# Altium schematic sheet Connectors.SchDoc
size 420 x 297 mm; Organization: Develer s.r.l.; Address1: via Mugellese 1/A; Address2: 50019 Campi Bisenzio; Address3: Firenze; Address4: ITALY; Revision: A; SheetNumber: 1; SheetTotal: 1
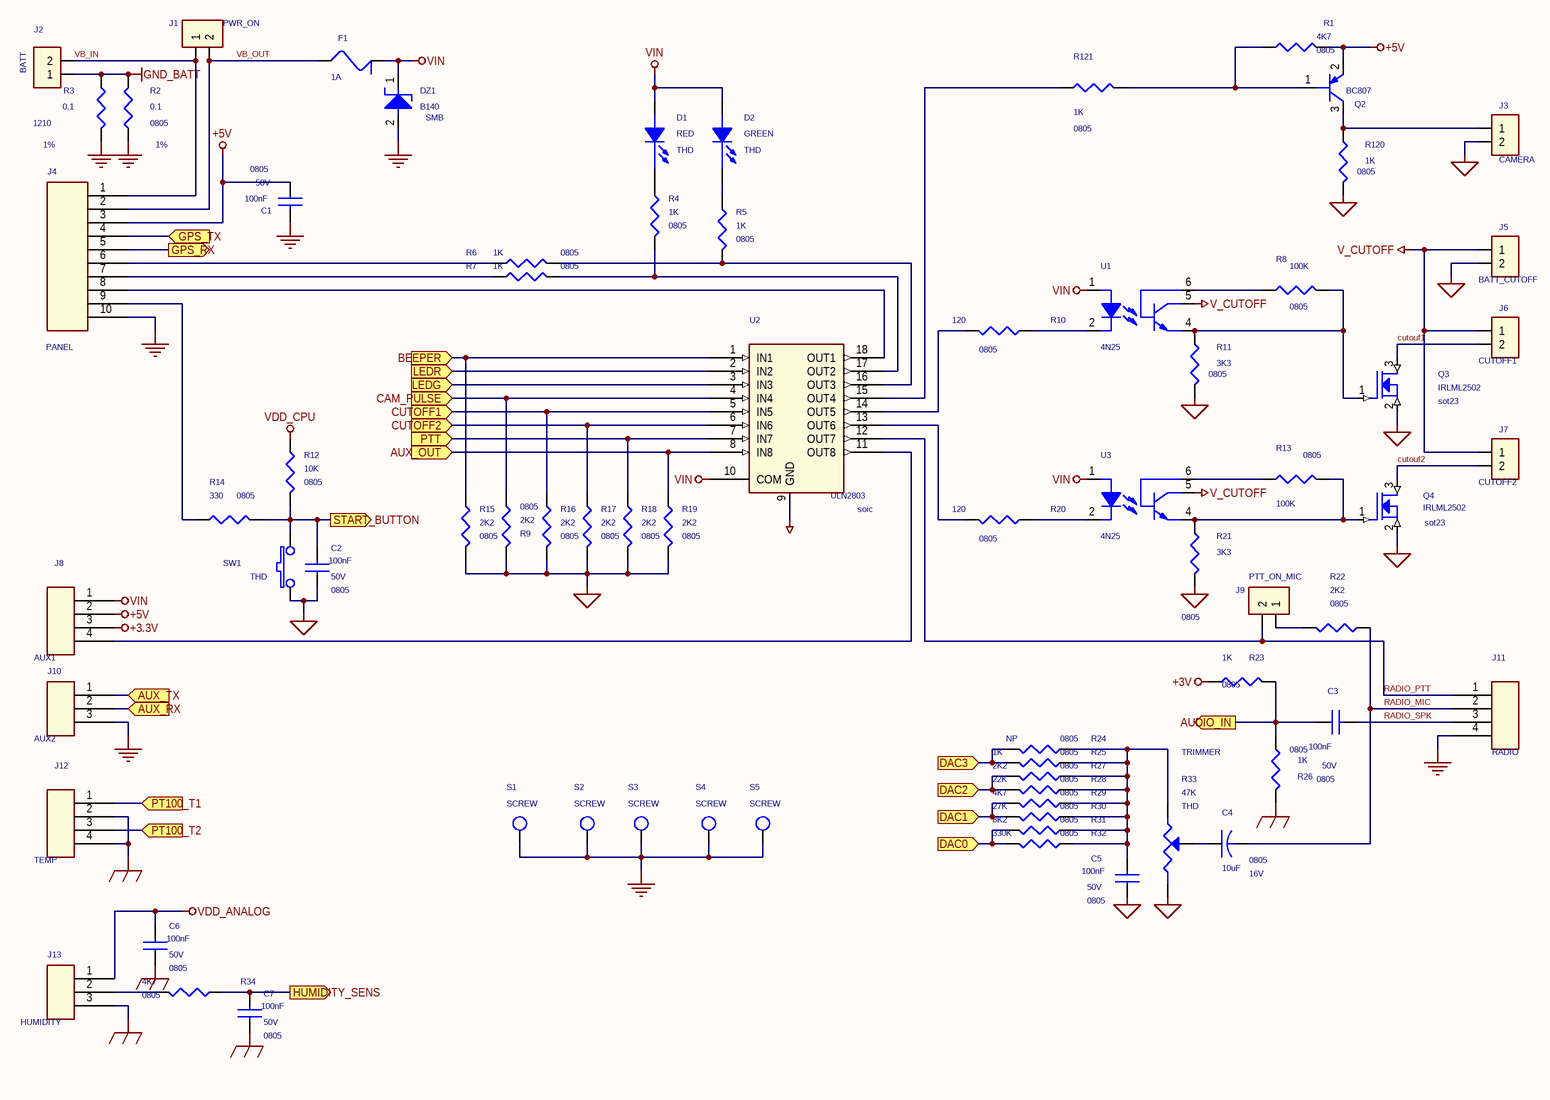
[diagram p0: Connectors.SchDoc]

## Parts
C1  100nF  case: 0805  voltage: 50V  [SM/C_0805]
C2  100nF  case: 0805  voltage: 50V  [SM/C_0805]
C3  100nF  voltage: 50V  case: 0805  [SM/C_0805]
C4  10uF  voltage: 16V  case: 0805  [SM/C_0805]
C5  100nF  case: 0805  voltage: 50V  [SM/C_0805]
C6  100nF  voltage: 50V  case: 0805  [SM/C_0805]
C7  100nF  voltage: 50V  case: 0805  [SM/C_0805]
D1  RED  case: THD  [LED/TM/R5]
D2  GREEN  case: THD  [LED/TM/R5]
DZ1  B140  case: SMB  [SM/DO214AC_12]
F1  1A  [TM/MF-R075]
J1  PWR_ON  [BLKCON.100/VH/TM1SQ/W.100/2]
J2  BATT  [TBLOCK_PCB/H/350/2]
J3  CAMERA  [TBLOCK_PCB/H/350/2]
J4  PANEL  [BLKCON.100/VH/TM2OE/W.200/10]
J5  BATT_CUTOFF  [TBLOCK_PCB/H/350/2]
J6  CUTOFF1  [TBLOCK_PCB/H/350/2]
J7  CUTOFF2  [TBLOCK_PCB/H/350/2]
J8  AUX1  [TBLOCK_PCB/H/350/4]
J9  PTT_ON_MIC  [BLKCON.100/VH/TM1SQ/W.100/2]
J10  AUX2  [TBLOCK_PCB/H/350/3]
J11  RADIO  [TBLOCK_PCB/H/350/4]
J12  TEMP  [TBLOCK_PCB/H/350/4]
J13  HUMIDITY  [TBLOCK_PCB/H/350/3]
Q2  BC807  [SM/SOT23_123]
Q3  IRLML2502  case: sot23  [SM/SOT23_123]
Q4  IRLML2502  case: sot23  [SM/SOT23_123]
R1  4K7  case: 0805  [SM/R_0805]
R2  0.1  1st: 1%  case: 0805  [SM/R_0805]
R3  0.1  1st: 1%  case: 1210  [SM/R_1210]
R4  1K  case: 0805  [SM/R_0805]
R5  1K  case: 0805  [SM/R_0805]
R6  1K  case: 0805  [SM/R_0805]
R7  1K  case: 0805  [SM/R_0805]
R8  100K  case: 0805  [SM/R_0805]
R9  2K2  case: 0805  [SM/R_0805]
R10  120  case: 0805  [SM/R_0805]
R11  3K3  case: 0805  [SM/R_0805]
R12  10K  case: 0805  [SM/R_0805]
R13  100K  case: 0805  [SM/R_0805]
R14  330  case: 0805  [SM/R_0805]
R15  2K2  case: 0805  [SM/R_0805]
R16  2K2  case: 0805  [SM/R_0805]
R17  2K2  case: 0805  [SM/R_0805]
R18  2K2  case: 0805  [SM/R_0805]
R19  2K2  case: 0805  [SM/R_0805]
R20  120  case: 0805  [SM/R_0805]
R21  3K3  case: 0805  [SM/R_0805]
R22  2K2  case: 0805  [SM/R_0805]
R23  1K  case: 0805  [SM/R_0805]
R24  NP  case: 0805  [SM/R_0805]
R25  1K  case: 0805  [SM/R_0805]
R26  1K  case: 0805  [SM/R_0805]
R27  2K2  case: 0805  [SM/R_0805]
R28  22K  case: 0805  [SM/R_0805]
R29  4K7  case: 0805  [SM/R_0805]
R30  27K  case: 0805  [SM/R_0805]
R31  8K2  case: 0805  [SM/R_0805]
R32  330K  case: 0805  [SM/R_0805]
R33  47K  case: THD  1st: TRIMMER  [VRES4]
R34  4K7  case: 0805  [SM/R_0805]
R120  1K  case: 0805  [SM/R_0805]
R121  1K  case: 0805  [SM/R_0805]
S1  SCREW  [SCREW/M3]
S2  SCREW  [SCREW/M3]
S3  SCREW  [SCREW/M3]
S4  SCREW  [SCREW/M3]
S5  SCREW  [SCREW/M3]
SW1  case: THD  [SWITCH/KSJ]  (hidden comment: START)
U1  4N25  [SMT/OPTO/6]
U2  ULN2803  case: soic  [SOJ.050/18/WB.400/L.450]
U3  4N25  [SMT/OPTO/6]

## Ports
AUDIO_IN (out), AUX_OUT (in), AUX_RX (in), AUX_TX (in), BEEPER (in), CAM_PULSE (in), CUTOFF1 (in), CUTOFF2 (in), DAC0 (in), DAC1 (in), DAC2 (in), DAC3 (in), GPS_RX (out), GPS_TX (in), HUMIDITY_SENS (out), LEDG (in), LEDR (in), PT100_T1 (in), PT100_T2 (in), PTT (in), START_BUTTON (out)

## Nets
+3.3V: J8.3
+3V: R23.2
+5V: C1.1 J4.3 J8.2 Q2.2(E) R1.2
GND: C1.2 DZ1.2 J4.10 J10.3 J11.4 R2.1 R3.1 S1.1(TP) S2.1(TP) S3.1(TP) S4.1(TP) S5.1(TP) U2.9(GND)  [also labelled GND_POWER]
GND_ANALOG: C6.1 C7.1 J12.2 J12.4 J13.3 R26.2
GND_BATT: J2.1 R2.2 R3.2
GND_CUTOFF: J5.2 Q3.2(S) Q4.2(S) R11.1 R21.1
GND_DIGITAL: C2.1 C5.1 J3.2 R9.2 R15.2 R16.2 R17.2 R18.2 R19.2 R33.3 R120.1 SW1.1
V_CUTOFF: J5.1 J6.1 J7.1 U1.5 U3.5
VDD_ANALOG: C6.2 J13.1
VDD_CPU: R12.1
VIN: D1.1(ANODE) D2.1(ANODE) DZ1.1 F1.2 J8.1 U1.1 U2.10(COM) U3.1
AUDIO_IN: C3.1 R23.1 R26.1 ; port AUDIO_IN
AUX_OUT: R19.1 U2.8(IN8) ; port AUX_OUT
AUX_RX: J10.2 ; port AUX_RX
AUX_TX: J10.1 ; port AUX_TX
BEEPER: R15.1 U2.1(IN1) ; port BEEPER
CAM_PULSE: R9.1 U2.4(IN4) ; port CAM_PULSE
CUTOFF1: R16.1 U2.5(IN5) ; port CUTOFF1
CUTOFF2: R17.1 U2.6(IN6) ; port CUTOFF2
cutouf1: J6.2 Q3.3(D)
cutouf2: J7.2 Q4.3(D)
DAC0: R31.1 R32.1 ; port DAC0
DAC1: R29.1 R30.1 ; port DAC1
DAC2: R27.1 R28.1 ; port DAC2
DAC3: R24.1 R25.1 ; port DAC3
GPS_RX: J4.5 ; port GPS_RX
GPS_TX: J4.4 ; port GPS_TX
HUMIDITY_SENS: C7.2 R34.2 ; port HUMIDITY_SENS
LEDG: U2.3(IN3) ; port LEDG
LEDR: U2.2(IN2) ; port LEDR
PT100_T1: J12.1 ; port PT100_T1
PT100_T2: J12.3 ; port PT100_T2
PTT: R18.1 U2.7(IN7) ; port PTT
RADIO_MIC: C4.2 J11.2 R22.2
RADIO_PTT: J9.2 J11.1 U2.12(OUT7)
RADIO_SPK: C3.2 J11.3
START_BUTTON: C2.2 R12.2 R14.2 SW1.2 ; port START_BUTTON
VB_IN: J1.1 J2.2 J4.1
VB_OUT: F1.1 J1.2 J4.2
NetC4_1: C4.1 R33.2
NetC5_2: C5.2 R24.2 R25.2 R27.2 R28.2 R29.2 R30.2 R31.2 R32.2 R33.1
NetD1_2: D1.2(CATHODE) R4.1
NetD2_2: D2.2(CATHODE) R5.1
NetJ3_1: J3.1 Q2.3(C) R120.2
NetJ4_6: J4.6 R6.1
NetJ4_7: J4.7 R7.1
NetJ4_8: J4.8 U2.18(OUT1)
NetJ4_9: J4.9 R14.1
NetJ8_4: J8.4 U2.11(OUT8)
NetJ9_1: J9.1 R22.1
NetJ13_2: J13.2 R34.1
NetQ2_1: Q2.1(B) R1.1 R121.1
NetQ3_1: Q3.1(G) R8.1 R11.2 U1.4
NetQ4_1: Q4.1(G) R13.1 R21.2 U3.4
NetR4_2: R4.2 R7.2 U2.17(OUT2)
NetR5_2: R5.2 R6.2 U2.16(OUT3)
NetR8_2: R8.2 U1.6
NetR10_1: R10.1 U2.14(OUT5)
NetR10_2: R10.2 U1.2
NetR13_2: R13.2 U3.6
NetR20_1: R20.1 U2.13(OUT6)
NetR20_2: R20.2 U3.2
NetR121_2: R121.2 U2.15(OUT4)

## Notes on the sheet
- Title:
- Size:
- Rev:
- A3
- Author:
- Approved:
- File:
- Date:
- Time:
- Sheet
- of

## Library data of the parts
C1-C3 C5-C7 = CAP NP: COMPGROUP: 1
C4 = C: COMPGROUP: 1
D1 D2 = LED: COMPGROUP: 1
DZ1 = ZENER_0: COMPGROUP: 1
F1 = FUSE: COMPGROUP: 1; case: THD
J1 J9 = CON2: COMPGROUP: 1; 1st: PINSTRIP; case: THD
J2 J3 J5-J7 = CON2: COMPGROUP: 1
J4 = CON10: COMPGROUP: 1; case: THD
J8 J11 J12 = CON4: COMPGROUP: 1
J10 J13 = CON3: COMPGROUP: 1; case: THD
Q2 = BC807: COMPGROUP: 1
Q3 Q4 = MOSFET N_1: COMPGROUP: 1
R1 R8 R13 R20 R21 R24-R26 R28 R31 R32 R34 R120 R121 = R: COMPGROUP: 1; 1st: 5%
R2 R3 = R_Dup1: 2nd: 100ppm; COMPGROUP: 1
R4-R7 R12 R14 R16-R19 = R_Dup1: 1st: 5%; 2nd: 100ppm; COMPGROUP: 1
R9 R15 = R_Dup1: 1st: 5%; COMPGROUP: 1; 2nd: 100ppm
R10 R11 R22 R23 R27 R29 R30 = R: 1st: 5%; COMPGROUP: 1
R33 = RV: COMPGROUP: 1
S1-S5 = T POINT R
SW1 = SW_PB_SPST: COMPGROUP: 1
U1 U3 = 4N25: COMPGROUP: 1; case: soic
U2 = ULN2803: COMPGROUP: 1